# Altium schematic sheet Regulador_y_pines.SchDoc
size A4
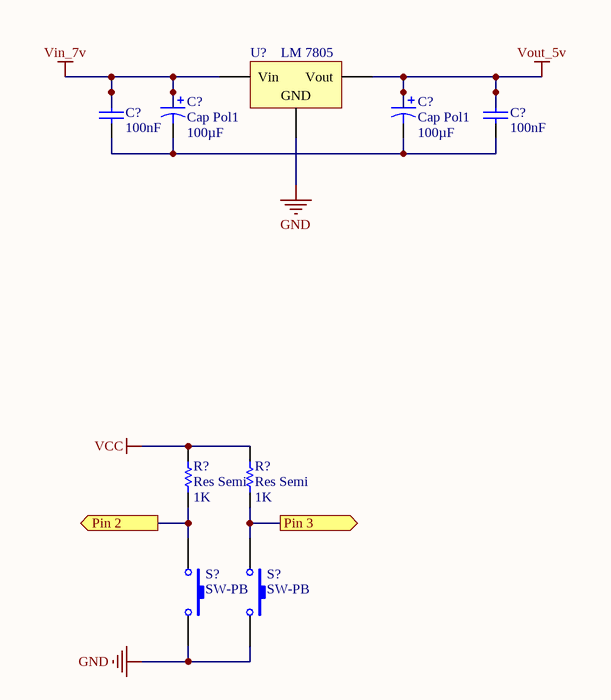
[diagram p0: Regulador_y_pines.SchDoc]

## Parts
(Parts that share a designator on the sheet are numbered #1, #2 ... from top to bottom, then left to right.)
C?#1  Cap Pol1  value 100µF  [RB7.6-15]
C?#2  Cap Pol1  value 100µF  [RB7.6-15]
C?#3  value 100nF  [CAPR5.08-7.8x3.2]  (hidden comment: Cap)
C?#4  value 100nF  [CAPR5.08-7.8x3.2]  (hidden comment: Cap)
R?#1  Res Semi  value 1K  [AXIAL-0.5]
R?#2  Res Semi  value 1K  [AXIAL-0.5]
S?#1  SW-PB  [SPST-2]
S?#2  SW-PB  [SPST-2]
U?  LM 7805  [TO220V]

## Ports
Pin 2 (out), Pin 3 (out)

## Nets
GND: S?#1.2 S?#2.2 U?.2(GND)
VCC: R?#1.2 R?#2.2
Vin_7v: C?#1.1 C?#3.2 U?.1(Vin)
Vout_5v: C?#2.1 C?#4.2 U?.3(Vout)
Pin 2: R?#1.1 S?#1.1 ; port Pin 2
Pin 3: R?#2.1 S?#2.1 ; port Pin 3
NetC?#1_2: C?#1.2 C?#2.2 C?#3.1 C?#4.1

## Library data of the parts
C?#1 C?#2 = Cap Pol1: Polarized Capacitor (Radial); Published: 8-Jun-2000; LatestRevisionDate: 17-Jul-2002; LatestRevisionNote: Re-released for DXP Platform.; PackageReference: RB7.6-15; Publisher: Altium Limited
C?#3 C?#4 = Cap: Capacitor; Published: 8-Jun-2000; LatestRevisionDate: 17-Jul-2002; LatestRevisionNote: Re-released for DXP Platform.; PackageReference: RAD-0.3; Publisher: Altium Limited
R?#1 R?#2 = Res Semi: Semiconductor Resistor; Published: 8-Jun-2000; LatestRevisionDate: 17-Jul-2002; LatestRevisionNote: Re-released for DXP Platform.; PackageReference: AXIAL-0.5; Publisher: Altium Limited
S?#1 S?#2 = SW-PB: Switch; Published: 24-Mar-1999; LatestRevisionDate: 17-Jul-2002; LatestRevisionNote: Re-released for DXP Platform.; PackageReference: SPST-2; Publisher: Altium Limited
U? = Volt Reg: Voltage Regulator; Published: 24-Mar-1999; LatestRevisionDate: 29-May-2009; LatestRevisionNote: IPC-7351 Footprint Added.; PackageReference: D2PAK; Publisher: Altium Limited; PackageDescription: 3-Pin Transistor Outline Package 2.54 mm Pitch, 15.1 mm Lead Span